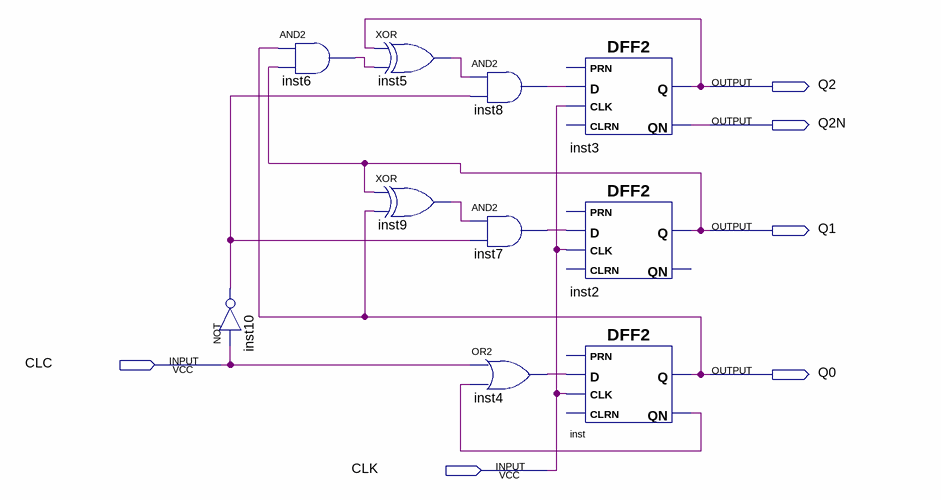
[diagram p0: schematic sheet]
// Quartus schematic contador.bdf as structural Verilog: 10 symbols, 6 pins
module contador (
  input  CLC,
  input  CLK,
  output Q2,
  output Q2N,
  output Q1,
  output Q0
);

  wire inst4_out, inst5_out, inst6_out, inst7_out, inst8_out, inst9_out, inst10_out, inst_qn;

  not inst10 (inst10_out, CLC);
  and inst6 (inst6_out, Q0, Q1);
  xor inst5 (inst5_out, Q2, inst6_out);
  xor inst9 (inst9_out, Q1, Q0);
  and inst8 (inst8_out, inst5_out, inst10_out);
  and inst7 (inst7_out, inst9_out, inst10_out);
  or inst4 (inst4_out, CLC, inst_qn);
  DFF2 inst3 (.CLK(CLK), .D(inst8_out), .Q(Q2), .QN(Q2N));  // open: PRN, CLRN
  DFF2 inst2 (.CLK(CLK), .D(inst7_out), .Q(Q1));  // open: PRN, CLRN, QN
  DFF2 inst (.CLK(CLK), .D(inst4_out), .Q(Q0), .QN(inst_qn));  // open: PRN, CLRN
endmodule
